# Altium schematic sheet Input.SchDoc
size A4; SheetNumber: 2; SheetTotal: 3
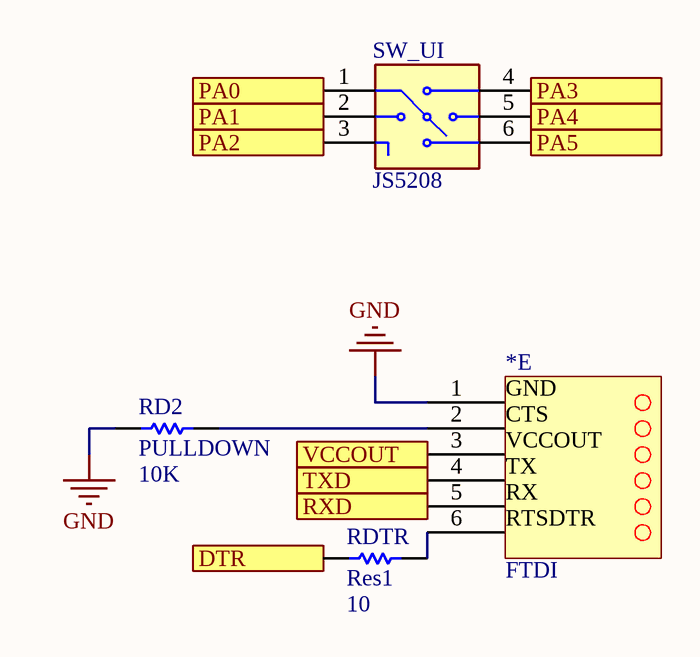
[diagram p0: Input.SchDoc]

## Parts
*  FTDI  (part E of 5)
RD2  PULLDOWN  value 10K  [AXIAL-0.1-RES]
RDTR  Res1  value 10  [AXIAL-0.1-RES]
SW_UI  JS5208  [SW_JS5208]

## Ports
DTR (out), PA0 (out), PA1 (out), PA2 (out), PA3 (out), PA4 (out), PA5 (out), RXD (in), TXD (out), VCCOUT (in)

## Nets
GND: RD2.1
DTR: RDTR.1 ; port DTR
PA0: SW_UI.1 ; port PA0
PA1: SW_UI.2 ; port PA1
PA2: SW_UI.3 ; port PA2
PA3: SW_UI.4 ; port PA3
PA4: SW_UI.5 ; port PA4
PA5: SW_UI.6 ; port PA5

Not connected (* = marked no-connect by the designer): * 1 2 3 4 5 6; RD2 2; RDTR 2

## Notes on the sheet
- (in symbol Component_1, part E) GND; CTS; VCCOUT; TX; RX; RTSDTR

## Library data of the parts
* = Component_1
RD2 = RES 10K OHM 5% 1/4W AXIAL: Resistor; Manufacturer Part Number: CFR-25JB-52-10K; Designator: R?; Power Rating: 1/4W; Tolerance: 0.05; Published: 8-Jun-2000; LatestRevisionDate: 17-Jul-2002; LatestRevisionNote: Re-released for DXP Platform.; Publisher: Altium Limited
RDTR = RES 10 OHM 5% 1/4W AXIAL: Resistor; Manufacturer Part Number: CFR-25JB-52-10R; Designator: R?; Power Rating: 1/4W; Tolerance: 0.05; Published: 8-Jun-2000; LatestRevisionDate: 17-Jul-2002; LatestRevisionNote: Re-released for DXP Platform.; Publisher: Altium Limited
SW_UI = JS5208: MP: JS5208; Availability: Unavailable; Package: None; Price: None; Value: *